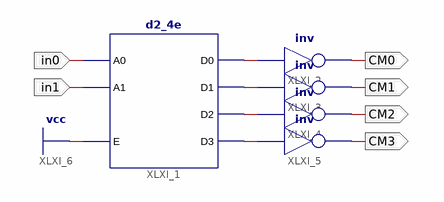
[diagram p0: schematic sheet 1]
// Xilinx ISE schematic Common_Selector.sch (spartan6) as structural Verilog: 5 symbols, 6 ports
module Common_Selector (
  input  in0,
  input  in1,
  output CM0,
  output CM1,
  output CM2,
  output CM3
);

  wire XLXN_3, XLXN_4, XLXN_5, XLXN_6;

  d2_4e XLXI_1 (.A0(in0), .A1(in1), .E(1'b1), .D0(XLXN_3), .D1(XLXN_4), .D2(XLXN_5), .D3(XLXN_6));
  not XLXI_2 (CM0, XLXN_3);
  not XLXI_3 (CM1, XLXN_4);
  not XLXI_4 (CM2, XLXN_5);
  not XLXI_5 (CM3, XLXN_6);
endmodule
